# Altium schematic sheet Sheet1.SchDoc
size A; SheetNumber: 1; SheetTotal: 1; SPICEModelCacheSIOHMRRA: <root> / <DocumentId>SIOHMRRA</DocumentId> / <CacheFrame Number="0"> / <Model Name="2n3904" Kind="MDL"> / <Text>*2N3904 / *Si 310mW  40V 200mA 300MHz pkg:TO-92B 1,2,3 / .MODEL 2N3904 NPN(IS=1.4E-14 BF=300 VAF=100 IKF=0.025 ISE=3E-13 / + BR=7.5 RC=2.4 CJE=4.5E-12 TF=4E-10 CJC=3.5E-12 TR=2.1E-8 XTB=1.5 KF=9E-16 )</Text> / </Model> / </CacheFrame> / </root>
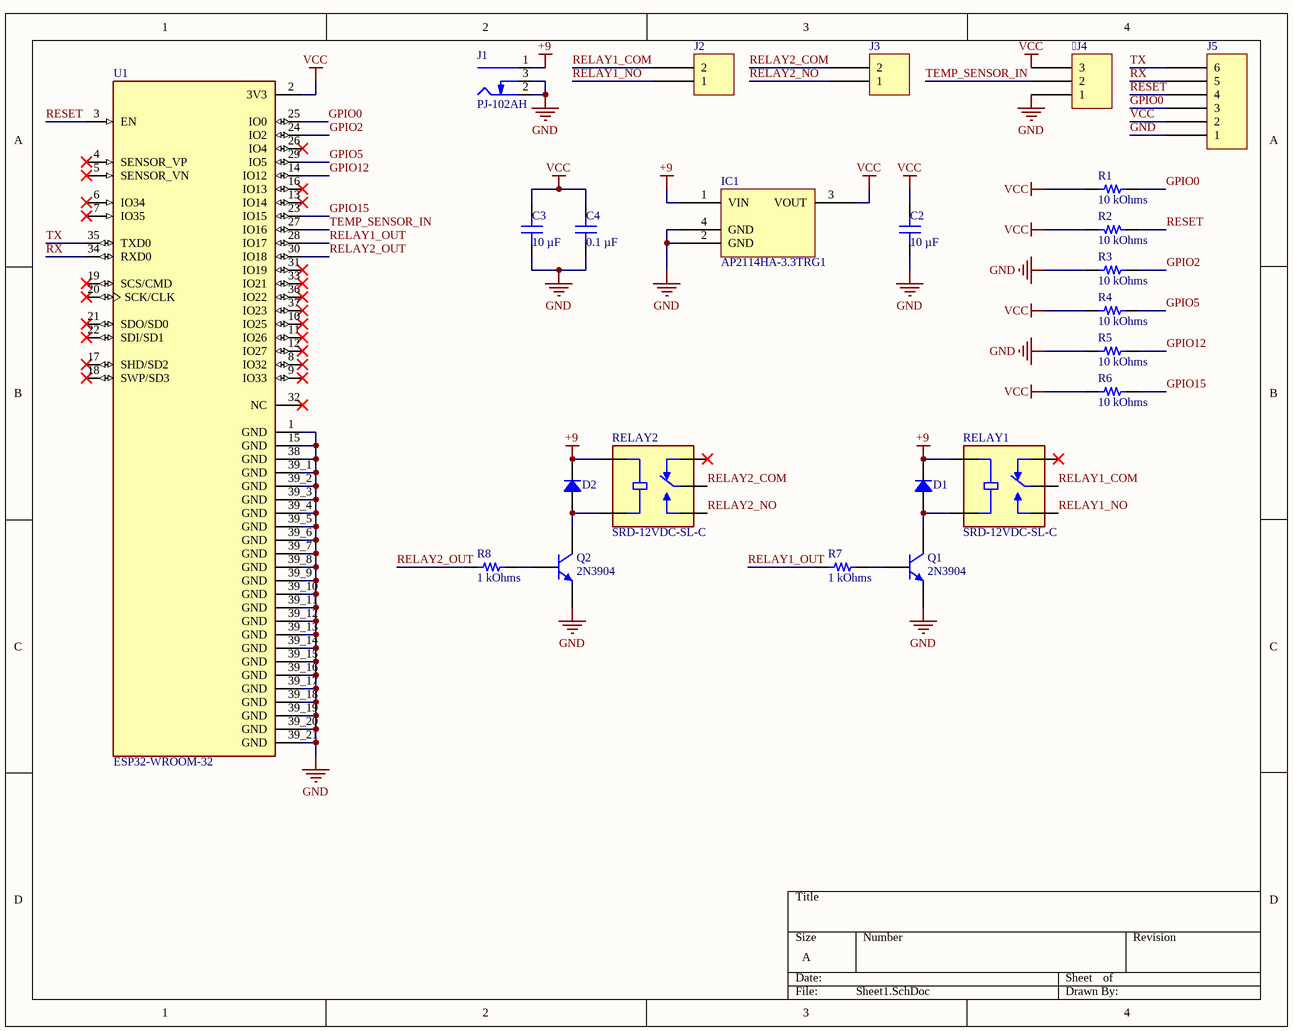
[diagram p0: Sheet1.SchDoc]

## Parts
J4  B3B-XH-A(LF)(SN)  [JST XH B3B-XH-A]  (value not drawn)
C2  Capacitance: 10 µF  [CAP 1206_3216 - 0.8MM]
C3  Capacitance: 10 µF  [CAP 1206_3216 - 0.8MM]
C4  Capacitance: 0.1 µF  [CAP 1206_3216 - 0.8MM]
D1  1N4007FLTR  [SOD123F]  (value not drawn)
D2  1N4007FLTR  [SOD123F]  (value not drawn)
IC1  AP2114HA-3.3TRG1  [DIODES SOT-223]
J1  PJ-102AH  [CUI PJ-102AH]
J2  282837-2  [TE 282837-2]  (value not drawn)
J3  282837-2  [TE 282837-2]  (value not drawn)
J5  B6B-XH-A(LF)(SN)  [JST XH B6B-XH-A]  (value not drawn)
Q1  2N3904  [TO-92A]
Q2  2N3904  [TO-92A]
R1  10 kOhms  [RES 1206_3216]
R2  10 kOhms  [RES 1206_3216]
R3  10 kOhms  [RES 1206_3216]
R4  10 kOhms  [RES 1206_3216]
R5  10 kOhms  [RES 1206_3216]
R6  10 kOhms  [RES 1206_3216]
R7  1 kOhms  [RES 1206_3216]
R8  1 kOhms  [RES 1206_3216]
RELAY1  SRD-12VDC-SL-C  [RELAY_SRD-12VDC-SL-C]
RELAY2  SRD-12VDC-SL-C  [RELAY_SRD-12VDC-SL-C]
U1  ESP32-WROOM-32  [MODULE_ESP32-WROOM-32]

## Nets
+9: D1.2 D2.2 IC1.1(VIN) J1.1(Centre) RELAY1.COIL1 RELAY2.COIL1
GND: J4.1 C2.1 C3.1 C4.1 IC1.2(GND) IC1.4(GND) J1.2(Outer) J1.3(SW) J5.1 Q1.1(E) Q2.1(E) R3.1 R5.1 U1.1(GND) U1.15(GND) U1.38(GND) U1.39_1(GND) U1.39_2(GND) U1.39_3(GND) U1.39_4(GND) U1.39_5(GND) U1.39_6(GND) U1.39_7(GND) U1.39_8(GND) U1.39_9(GND) U1.39_10(GND) U1.39_11(GND) U1.39_12(GND) U1.39_13(GND) U1.39_14(GND) U1.39_15(GND) U1.39_16(GND) U1.39_17(GND) U1.39_18(GND) U1.39_19(GND) U1.39_20(GND) U1.39_21(GND)
VCC: J4.3 C2.2 C3.2 C4.2 IC1.3(VOUT) J5.2 R1.1 R2.2 R4.1 R6.1 U1.2(3V3)
GPIO0: J5.3 R1.2 U1.25(IO0)
GPIO2: R3.2 U1.24(IO2)
GPIO5: R4.2 U1.29(IO5)
GPIO12: R5.2 U1.14(IO12)
GPIO15: R6.2 U1.23(IO15)
RELAY1_COM: J2.2 RELAY1.COM
RELAY1_NO: J2.1 RELAY1.NO
RELAY1_OUT: R7.1 U1.28(IO17)
RELAY2_COM: J3.2 RELAY2.COM
RELAY2_NO: J3.1 RELAY2.NO
RELAY2_OUT: R8.1 U1.30(IO18)
RESET: J5.4 R2.1 U1.3(EN)
RX: J5.5 U1.34(RXD0)
TEMP_SENSOR_IN: J4.2 U1.27(IO16)
TX: J5.6 U1.35(TXD0)
NetD1_1: D1.1 Q1.3(C) RELAY1.COIL2
NetD2_1: D2.1 Q2.3(C) RELAY2.COIL2
NetQ1_2: Q1.2(B) R7.2
NetQ2_2: Q2.2(B) R8.2

Not connected (* = marked no-connect by the designer): RELAY1 NC*; RELAY2 NC*; U1 4(SENSOR_VP)* 5(SENSOR_VN)* 6(IO34)* 7(IO35)* 8(IO32)* 9(IO33)* 10(IO25)* 11(IO26)* 12(IO27)* 13(IO14)* 16(IO13)* 17(SHD/SD2)* 18(SWP/SD3)* 19(SCS/CMD)* 20(SCK/CLK)* 21(SDO/SD0)* 22(SDI/SD1)* 26(IO4)* 31(IO19)* 32(NC)* 33(IO21)* 36(IO22)* 37(IO23)*

## Library data of the parts
J4 = B3B-XH-A(LF)(SN): CONN HEADER VERT 3POS 2.5MM; Manufacturer: JST Sales America Inc.; Contact Length - Post: 0.134" (3.40mm); Current Rating (Amps): 3A; Material Flammability Rating: UL94 V-0; Number of Positions: 3; Number of Positions Loaded: All; Pitch - Mating: 0.098" (2.50mm); Shrouding: Shrouded - 4 Wall; Style: Board to Cable/Wire; Voltage Rating: 250V; Part Number: B3B-XH-A(LF)(SN); ComponentLink1Description: Datasheet; ComponentLink1URL: http://www.jst-mfg.com/product/pdf/eng/eXH.pdf; ComponentLink2Description: DigiKey Link; ComponentLink2URL: http://digikey.com/product-detail/en/jst-sales-america-inc/B3B-XH-A-LF-SN/455-2248-ND/1651046; Connector Type: Header; Contact Finish - Mating: Tin; Contact Finish - Post: Tin; Contact Material: Brass; Contact Shape: Square; Contact Type: Male Pin; Fastening Type: Detent Lock; Insulation Color: Natural; Insulation Height: 0.276" (7.00mm); Insulation Material: Polyamide (PA66), Nylon 6/6; LastUpdated: 1/12/2020 11:46:22 PM; Lifecycle Status: Active; Minimum Order: 1; Mounting Type: Through Hole; Number of Rows: 1; Operating Temperature: -25°C ~ 85°C; Packaging: Bulk; PartId: 68; Part Status: Active; Price: 0.19; Series: XH; Supplier 1: DigiKey; Supplier Part Number 1: 455-2248-ND; Termination: Press-Fit, Solder
C2 C3 = EMK316BJ106MD-T: CAP CER 10UF 16V X5R 1206; Part Number: EMK316BJ106MD-T
C4 = CC1206MRY5V9BB104: CAP CER 0.1UF 50V Y5V 1206; Part Number: CC1206MRY5V9BB104
D1 D2 = 1N4007FLTR: STANDARD RECTIFIER 1000V SOD-123; Manufacturer: SMC Diode Solutions; Capacitance @ Vr, F: 15pF @ 4V, 1MHz; Current - Average Rectified (Io): 1A; Current - Reverse Leakage @ Vr: 5µA @ 1000V; Speed: Standard Recovery >500ns, > 200mA (Io); Voltage - Forward (Vf) (Max) @ If: 1.1V @ 1A; Part Number: 1N4007FLTR; ComponentLink1Description: Datasheet; ComponentLink1URL: http://www.smc-diodes.com/propdf/1N4001FL-1N4007FL%20N1646%20REV.A.pdf; ComponentLink2Description: DigiKey Link; ComponentLink2URL: http://digikey.com/product-detail/en/smc-diode-solutions/1N4007FLTR/1655-1N4007FLCT-ND/11657827; Diode Type: Standard; LastUpdated: 8/30/2020 8:59:55 PM; Lifecycle Status: Active; Minimum Order: 1; Mounting Type: Surface Mount; Package / Case: SOD-123F; Packaging: TapeAndReel; PartId: 3314; Price: 0.01; Supplier 1: DigiKey; Supplier Part Number 1: 1655-1N4007FLCT-ND; Supplier Device Package: SOD-123FL; Voltage - DC Reverse (Vr) (Max): 1000V
IC1 = AP2114HA-3.3TRG1: IC REG LINEAR 3.3V 1A SOT-223-3; Manufacturer: Diodes Incorporated; Current - Quiescent (Iq): 90 µA; Number of Regulators: 1; Output Configuration: Positive; Output Type: Fixed; Protection Features: Over Current, Over Temperature; PSRR: 65dB (100Hz ~ 1kHz); Voltage Dropout (Max): 0.75V @ 1A; Voltage - Input (Max): 6V; Part Number: AP2114HA-3.3TRG1; ComponentLink1Description: Datasheet; ComponentLink1URL: https://www.diodes.com/assets/Datasheets/AP2114.pdf; ComponentLink2Description: DigiKey Link; ComponentLink2URL: https://www.digikey.com/en/products/detail/diodes-incorporated/AP2114HA-3-3TRG1/4770627; Current - Output: 1A; LastUpdated: 4/5/2026 9:04:43 PM; Lifecycle Status: Active; Minimum Order: 1; Mounting Type: Surface Mount; Operating Temperature: -40°C ~ 85°C; Package / Case: TO-261-4, TO-261AA; Packaging: TapeAndReel; Part Status: Active; Price: 0.08; Series: -; Supplier 1: DigiKey; Supplier Part Number 1: AP2114HA-3.3TRG1DICT-ND; Supplier Device Package: SOT-223-3; Voltage - Output (Min/Fixed): 3.3V
J1 = PJ-102AH: CONN PWR JACK 2X5.5MM SOLDER; Manufacturer: CUI Devices; Actual Diameter: 0.079" (2.00mm ID), 0.256" (6.50mm OD); Current Rating (Amps): 5A; Gender: Male; Industry Recognized Mating Diameter: 2.00mm ID (0.079"), 5.50mm OD (0.217"); Internal Switch(s): Single Switch, Normally Closed; Material Flammability Rating: UL94 V-0; Mating Length/Depth: 0.354" (9.00mm); Number of Positions/Contacts: 2 Conductors, 3 Contacts; Shielding: Unshielded; Voltage - Rated: 24VDC; Part Number: PJ-102AH; ComponentLink1Description: Datasheet; ComponentLink1URL: https://www.cuidevices.com/product/resource/digikeypdf/pj-102ah.pdf; ComponentLink2Description: DigiKey Link; ComponentLink2URL: //digikey.com/product-detail/en/cui-devices/PJ-102AH/CP-102AH-ND/408448; Connector Type: Jack; LastUpdated: 12/16/2019 7:01:27 PM; Lifecycle Status: 0; Minimum Order: 1; Mounting Type: Through Hole, Right Angle; Packaging: Tray; Part Status: Active; Price: 0.76; Series: -; Supplier 1: DigiKey; Supplier Part Number 1: CP-102AH-ND; Termination: Solder
J2 J3 = 282837-2: TERM BLK 2P SIDE ENT 5.08MM PCB; Manufacturer: TE Connectivity AMP Connectors; Current: 13.5 A; Mating Orientation: Horizontal with Board; Number of Levels: 1; Pitch: 0.200" (5.08mm); Positions Per Level: 2; Voltage: 300 V; Wire Gauge: 16-28 AWG; Wire Termination: Screw - Rising Cage Clamp; Part Number: 282837-2; Color: Green; ComponentLink1Description: Datasheet; ComponentLink1URL: https://www.te.com/commerce/DocumentDelivery/DDEController?Action=srchrtrv&DocNm=282837&DocType=Customer+Drawing&DocLang=English; ComponentLink2Description: DigiKey Link; ComponentLink2URL: https://www.digikey.com/en/products/detail/te-connectivity-amp-connectors/282837-2/2187973; Features: Interlocking (Side); LastUpdated: 6/21/2022 3:00:23 PM; Lifecycle Status: Active; Minimum Order: 1; Mounting Type: Through Hole; Packaging: Tray; Part Status: Active; Price: 0.31; Series: Buchanan; Supplier 1: DigiKey; Supplier Part Number 1: A113320-ND
J5 = B6B-XH-A(LF)(SN): CONN HEADER VERT 6POS 2.5MM; Part Number: B6B-XH-A(LF)(SN)
Q1 Q2 = 2N3904: NPN General Purpose Amplifier; Published: 8-Jun-2000; LatestRevisionDate: 15-Jan-2003; LatestRevisionNote: PCB Footprint 'BCY-W3/D4.7' replaced; DatasheetVersion: 1997; PackageVersion: Sep-1998; PackageReference: TO-92A; Publisher: Altium Limited; PackageDescription: TO, Flat Index; 3 In-Line, Axial Leads; Body Dia. 4.5mm; Leads 0.51 x 0.48 mm (max); ComponentLink1Description: Manufacturer Link; ComponentLink1URL: http://www.fairchildsemi.com/; ComponentLink2Description: Datasheet; ComponentLink2URL: http://www.fairchildsemi.com/ds/2N%2F2N3904.pdf
R1-R8 = CRG1206F10K: RES SMD 10K OHM 1% 1/4W 1206; Manufacturer: TE Connectivity Passive Product; Power (Watts): 0.25W, 1/4W; Temperature Coefficient: ±100ppm/°C; Part Number: CRG1206F10K; ComponentLink1Description: Datasheet; ComponentLink1URL: https://www.te.com/commerce/DocumentDelivery/DDEController?Action=srchrtrv&DocNm=1773204&DocType=DS&DocLang=English; ComponentLink2Description: DigiKey Link; ComponentLink2URL: https://www.digikey.com/en/products/detail/te-connectivity-passive-product/CRG1206F10K/2389909; Composition: Thick Film; Device Package: 1206 (3216 Metric); Height - Seated (Max): 0.026" (0.65mm); LastUpdated: 4/6/2026 8:00:52 PM; Lifecycle Status: Active; Minimum Order: 1; Number of Terminations: 2; Operating Temperature: -55°C ~ 155°C; Package / Case: 1206 (3216 Metric); Packaging: TapeAndReel; PartId: 26989; Part Status: Active; Price: 0.01; Series: CRG, Neohm; Size / Dimension: 0.122" L x 0.061" W (3.10mm x 1.55mm); Supplier 1: DigiKey; Supplier Part Number 1: A106069CT-ND; Supplier Device Package: 1206; Tolerance: ±1%
  R1-R6: Resistance: 10 kOhms; Value: 10 kOhms
  R7 R8: Resistance: 1 kOhms; Value: 1 kOhms
RELAY1 RELAY2 = SRD-12VDC-SL-C: General Purpose Non Latching 12VDC SPDT Through Hole Relays RoHS; MF: Songle Relay; SnapEDA_Link: https://www.snapeda.com/parts/SRD-12VDC-SL-C/Songle+Relay/view-part/?ref=snap; Package: NON STANDARD-5 Songle Relay; Value: *; MP: SRD-12VDC-SL-C; Check_prices: https://www.snapeda.com/parts/SRD-12VDC-SL-C/Songle+Relay/view-part/?ref=eda
U1 = ESP32-WROOM-32: Bluetooth, WiFi 802.11b/g/n, Bluetooth v4.2 +EDR, Class 1, 2 and 3 Transceiver Module 2.4GHz ~ 2.5GHz Antenna Not Included, U.FL Surface Mount; MF: Espressif Systems; Price: None; Availability: In Stock; MP: ESP32-WROOM-32; Package: Module Espressif Systems; SnapEDA_Link: https://www.snapeda.com/parts/ESP32-WROOM-32/Espressif+Systems/view-part/?ref=snap; Check_prices: https://www.snapeda.com/parts/ESP32-WROOM-32/Espressif+Systems/view-part/?ref=eda; Value: *; Purchase-URL: https://pricing.snapeda.com/search/part/ESP32-WROOM-32/?ref=eda